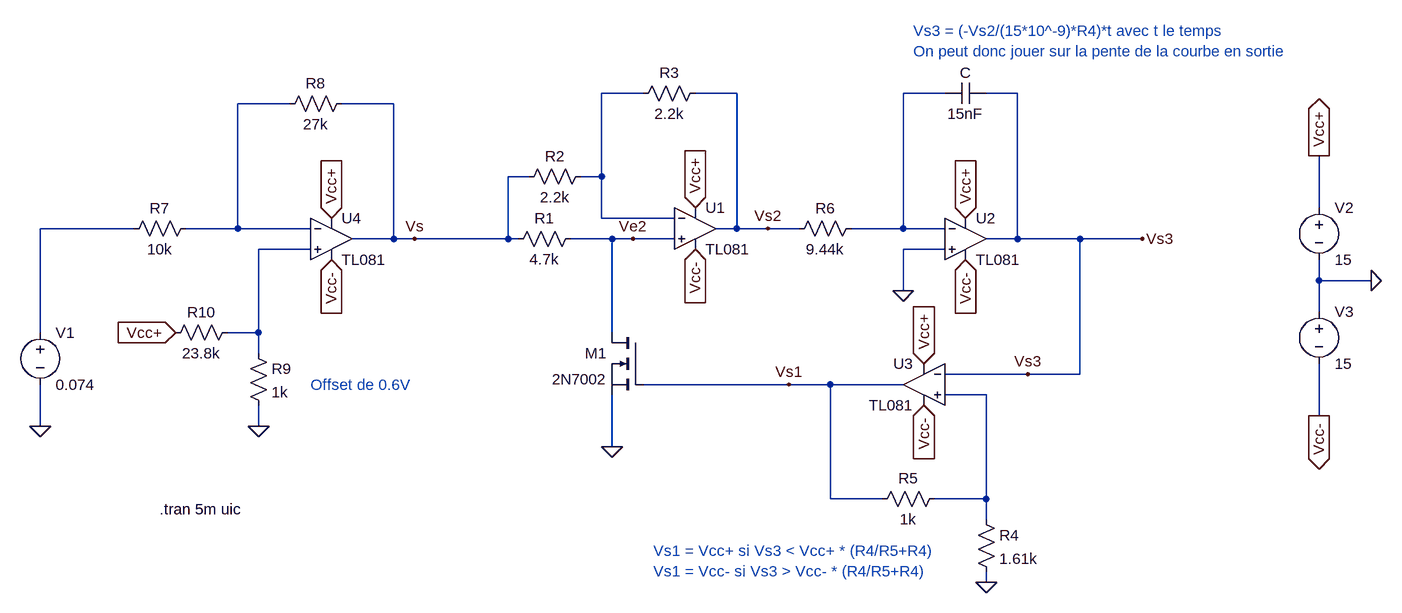
[diagram p0: schematic VCO.asc]
VCO.asc, the LTspice schematic file:
Version 4
SHEET 1 1108 680
WIRE -32 -256 -96 -256
WIRE 112 -256 48 -256
WIRE 432 -256 368 -256
WIRE 544 -256 496 -256
WIRE -576 -240 -656 -240
WIRE -416 -240 -496 -240
WIRE -208 -128 -240 -128
WIRE -96 -128 -96 -256
WIRE -96 -128 -128 -128
WIRE 1008 -80 1008 -160
WIRE -96 -64 -96 -128
WIRE 16 -64 -96 -64
WIRE -816 -48 -960 -48
WIRE -656 -48 -656 -240
WIRE -656 -48 -736 -48
WIRE -544 -48 -656 -48
WIRE 112 -48 112 -256
WIRE 112 -48 80 -48
WIRE 160 -48 112 -48
WIRE 208 -48 160 -48
WIRE 368 -48 368 -256
WIRE 368 -48 288 -48
WIRE 432 -48 368 -48
WIRE -416 -32 -416 -240
WIRE -416 -32 -480 -32
WIRE -384 -32 -416 -32
WIRE -240 -32 -240 -128
WIRE -240 -32 -384 -32
WIRE -224 -32 -240 -32
WIRE -80 -32 -144 -32
WIRE -48 -32 -80 -32
WIRE 16 -32 -48 -32
WIRE 544 -32 544 -256
WIRE 544 -32 496 -32
WIRE 640 -32 544 -32
WIRE 736 -32 640 -32
WIRE -544 -16 -624 -16
WIRE 432 -16 368 -16
WIRE 1008 32 1008 0
WIRE 1088 32 1008 32
WIRE 368 48 368 -16
WIRE 1008 80 1008 32
WIRE -960 112 -960 -48
WIRE -624 112 -624 -16
WIRE -624 112 -672 112
WIRE -80 112 -80 -32
WIRE -624 144 -624 112
WIRE 560 176 432 176
WIRE 640 176 640 -32
WIRE 640 176 560 176
WIRE 192 192 -32 192
WIRE 256 192 192 192
WIRE 368 192 256 192
WIRE 496 208 432 208
WIRE 1008 240 1008 160
WIRE -960 256 -960 192
WIRE -624 256 -624 224
WIRE -80 288 -80 208
WIRE 256 368 256 192
WIRE 336 368 256 368
WIRE 496 368 496 208
WIRE 496 368 416 368
WIRE 496 400 496 368
WIRE 496 496 496 480
FLAG 1088 32 0
FLAG 1008 -160 Vcc+
IOPIN 1008 -160 Out
FLAG 1008 240 Vcc-
IOPIN 1008 240 Out
FLAG 48 -80 Vcc+
IOPIN 48 -80 In
FLAG 48 -16 Vcc-
IOPIN 48 -16 In
FLAG 368 48 0
FLAG 400 160 Vcc+
IOPIN 400 160 In
FLAG 464 -64 Vcc+
IOPIN 464 -64 In
FLAG 464 0 Vcc-
IOPIN 464 0 In
FLAG 400 224 Vcc-
IOPIN 400 224 In
FLAG -80 288 0
FLAG 496 496 0
FLAG -960 256 0
FLAG -624 256 0
FLAG -752 112 Vcc+
IOPIN -752 112 In
FLAG -512 -64 Vcc+
IOPIN -512 -64 In
FLAG -512 0 Vcc-
IOPIN -512 0 In
FLAG 736 -32 Vs3
FLAG 192 192 Vs1
FLAG 160 -48 Vs2
FLAG -384 -32 Vs
FLAG 560 176 Vs3
FLAG -48 -32 Ve2
SYMBOL TL081 48 -112 R0
SYMATTR InstName U1
SYMBOL voltage 1008 -96 R0
WINDOW 123 0 0 Left 0
WINDOW 39 0 0 Left 0
SYMATTR InstName V2
SYMATTR Value 15
SYMBOL voltage 1008 64 R0
WINDOW 123 0 0 Left 0
WINDOW 39 0 0 Left 0
SYMATTR InstName V3
SYMATTR Value 15
SYMBOL res 64 -272 R90
WINDOW 0 0 56 VBottom 2
WINDOW 3 32 56 VTop 2
SYMATTR InstName R3
SYMATTR Value 2.2k
SYMBOL res -112 -144 R90
WINDOW 0 0 56 VBottom 2
WINDOW 3 32 56 VTop 2
SYMATTR InstName R2
SYMATTR Value 2.2k
SYMBOL res -128 -48 R90
WINDOW 0 0 56 VBottom 2
WINDOW 3 32 56 VTop 2
SYMATTR InstName R1
SYMATTR Value 4.7k
SYMBOL res 304 -64 R90
WINDOW 0 0 56 VBottom 2
WINDOW 3 32 56 VTop 2
SYMATTR InstName R6
SYMATTR Value 9.44k
SYMBOL TL081 464 -96 R0
SYMATTR InstName U2
SYMBOL cap 496 -272 R90
WINDOW 0 0 32 VBottom 2
WINDOW 3 32 32 VTop 2
SYMATTR InstName C
SYMATTR Value 15nF
SYMBOL TL081 400 128 M0
SYMATTR InstName U3
SYMBOL nmos -32 112 M0
SYMATTR InstName M1
SYMATTR Value 2N7002
SYMBOL res 432 352 R90
WINDOW 0 0 56 VBottom 2
WINDOW 3 32 56 VTop 2
SYMATTR InstName R5
SYMATTR Value 1k
SYMBOL res 480 384 R0
SYMATTR InstName R4
SYMATTR Value 1.61k
SYMBOL TL081 -512 -96 R0
SYMATTR InstName U4
SYMBOL voltage -960 96 R0
WINDOW 123 0 0 Left 0
WINDOW 39 0 0 Left 0
SYMATTR InstName V1
SYMATTR Value 0.074
SYMBOL res -720 -64 R90
WINDOW 0 0 56 VBottom 2
WINDOW 3 32 56 VTop 2
SYMATTR InstName R7
SYMATTR Value 10k
SYMBOL res -480 -256 R90
WINDOW 0 0 56 VBottom 2
WINDOW 3 32 56 VTop 2
SYMATTR InstName R8
SYMATTR Value 27k
SYMBOL res -640 128 R0
SYMATTR InstName R9
SYMATTR Value 1k
SYMBOL res -656 96 R90
WINDOW 0 0 56 VBottom 2
WINDOW 3 32 56 VTop 2
SYMATTR InstName R10
SYMATTR Value 23.8k
TEXT -16 448 Left 2 ;Vs1 = Vcc+ si Vs3 < Vcc+ * (R4/R5+R4)\nVs1 = Vcc- si Vs3 > Vcc- * (R4/R5+R4)
TEXT 384 -352 Left 2 ;Vs3 = (-Vs2/(15*10^-9)*R4)*t avec t le temps\nOn peut donc jouer sur la pente de la courbe en sortie
TEXT -776 384 Left 2 !.tran 5m uic
TEXT -544 192 Left 2 ;Offset de 0.6V

The netlist it stands for:
* VCO.asc
* U1: TL081 (symbol TL081 not available, pins judged from their places): In+=Ve2 In-=N001 V+=Vcc+ V-=Vcc- OUT=Vs2
V2 Vcc+ 0 15
V3 0 Vcc- 15
R3 Vs2 N001 2.2k
R2 N001 Vs 2.2k
R1 Ve2 Vs 4.7k
R6 N002 Vs2 9.44k
* U2: TL081 (symbol TL081 not available, pins judged from their places): In+=0 In-=N002 V+=Vcc+ V-=Vcc- OUT=Vs3
C Vs3 N002 15nF
* U3: TL081 (symbol TL081 not available, pins judged from their places): In+=N006 In-=Vs3 V+=Vcc+ V-=Vcc- OUT=Vs1
M1 Ve2 Vs1 0 0 2N7002
R5 N006 Vs1 1k
R4 N006 0 1.61k
* U4: TL081 (symbol TL081 not available, pins judged from their places): In+=N005 In-=N003 V+=Vcc+ V-=Vcc- OUT=Vs
V1 N004 0 0.074
R7 N003 N004 10k
R8 Vs N003 27k
R9 N005 0 1k
R10 N005 Vcc+ 23.8k
.model NMOS NMOS
.model PMOS PMOS
.lib standard.mos
* Vs1 = Vcc+ si Vs3 < Vcc+ * (R4/R5+R4)
* Vs1 = Vcc- si Vs3 > Vcc- * (R4/R5+R4)
* Vs3 = (-Vs2/(15*10^-9)*R4)*t avec t le temps
* On peut donc jouer sur la pente de la courbe en sortie
.tran 5m uic
* Offset de 0.6V
.backanno
.end